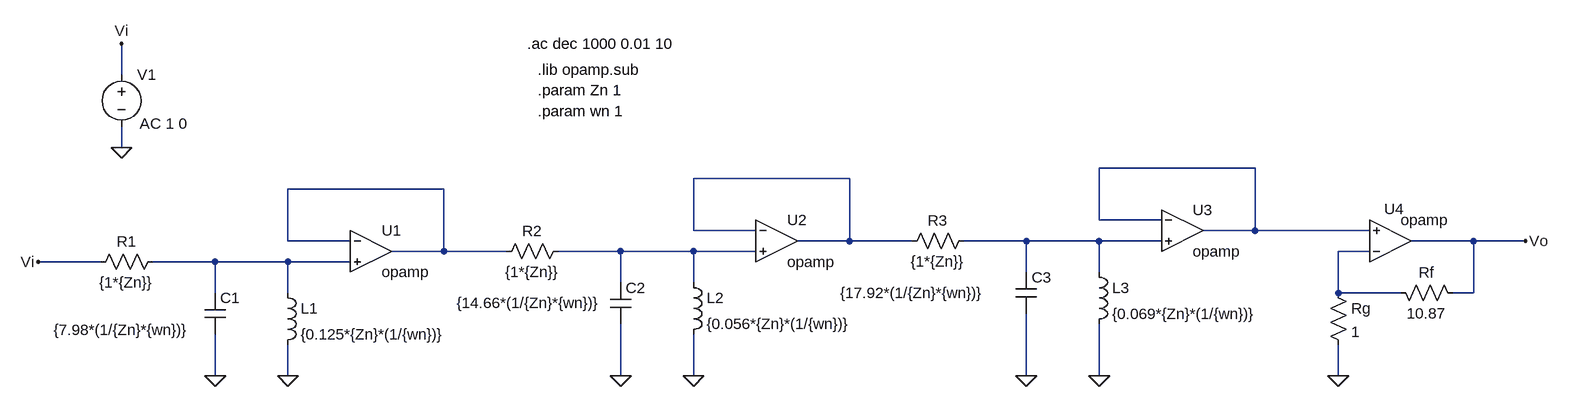
[diagram p0: schematic Circuito_norm.asc]
Circuito_norm.asc, the LTspice schematic file:
Version 4
SHEET 1 1968 680
WIRE -240 -160 -240 -208
WIRE -240 -48 -240 -80
WIRE 1504 -16 1264 -16
WIRE 880 0 640 0
WIRE 256 16 16 16
WIRE 1264 64 1264 -16
WIRE 1360 64 1264 64
WIRE 640 80 640 0
WIRE 736 80 640 80
WIRE 1504 80 1504 -16
WIRE 1504 80 1424 80
WIRE 1680 80 1504 80
WIRE 16 96 16 16
WIRE 112 96 16 96
WIRE 880 96 880 0
WIRE 880 96 800 96
WIRE 976 96 880 96
WIRE 1152 96 1056 96
WIRE 1264 96 1152 96
WIRE 1360 96 1264 96
WIRE 1840 96 1744 96
WIRE 1920 96 1840 96
WIRE 256 112 256 16
WIRE 256 112 176 112
WIRE 352 112 256 112
WIRE 528 112 432 112
WIRE 640 112 528 112
WIRE 736 112 640 112
WIRE 1680 112 1632 112
WIRE -272 128 -368 128
WIRE -96 128 -192 128
WIRE 16 128 -96 128
WIRE 112 128 16 128
WIRE 1152 144 1152 96
WIRE 1264 144 1264 96
WIRE 528 160 528 112
WIRE 640 160 640 112
WIRE -96 176 -96 128
WIRE 16 176 16 128
WIRE 1632 176 1632 112
WIRE 1728 176 1632 176
WIRE 1840 176 1840 96
WIRE 1840 176 1808 176
WIRE -96 304 -96 240
WIRE 16 304 16 256
WIRE 528 304 528 224
WIRE 640 304 640 240
WIRE 1152 304 1152 208
WIRE 1264 304 1264 224
WIRE 1632 304 1632 256
FLAG -96 304 0
FLAG 16 304 0
FLAG -368 128 Vi
FLAG -240 -208 Vi
FLAG -240 -48 0
FLAG 528 304 0
FLAG 640 304 0
FLAG 1152 304 0
FLAG 1264 304 0
FLAG 1632 304 0
FLAG 1920 96 Vo
SYMBOL OpAmps\\opamp 144 48 R0
SYMATTR InstName U1
SYMBOL res -176 112 R90
WINDOW 0 0 56 VBottom 2
WINDOW 3 32 56 VTop 2
SYMATTR InstName R1
SYMATTR Value {1*{Zn}}
SYMBOL cap -112 176 R0
WINDOW 3 -232 57 Left 2
SYMATTR Value {7.98*(1/{Zn}*{wn})}
SYMATTR InstName C1
SYMBOL ind 0 160 R0
SYMATTR InstName L1
SYMATTR Value {0.125*{Zn}*(1/{wn})}
SYMBOL OpAmps\\opamp 768 32 R0
SYMATTR InstName U2
SYMBOL res 448 96 R90
WINDOW 0 0 56 VBottom 2
WINDOW 3 32 56 VTop 2
SYMATTR InstName R2
SYMATTR Value {1*{Zn}}
SYMBOL cap 512 160 R0
WINDOW 3 -236 31 Left 2
SYMATTR Value {14.66*(1/{Zn}*{wn})}
SYMATTR InstName C2
SYMBOL ind 624 144 R0
SYMATTR InstName L2
SYMATTR Value {0.056*{Zn}*(1/{wn})}
SYMBOL OpAmps\\opamp 1392 16 R0
SYMATTR InstName U3
SYMBOL res 1072 80 R90
WINDOW 0 0 56 VBottom 2
WINDOW 3 32 56 VTop 2
SYMATTR InstName R3
SYMATTR Value {1*{Zn}}
SYMBOL cap 1136 144 R0
WINDOW 3 -270 32 Left 2
SYMATTR Value {17.92*(1/{Zn}*{wn})}
SYMATTR InstName C3
SYMBOL ind 1248 128 R0
SYMATTR InstName L3
SYMATTR Value {0.069*{Zn}*(1/{wn})}
SYMBOL voltage -240 -176 R0
WINDOW 123 28 91 Left 2
WINDOW 39 0 0 Left 0
SYMATTR Value2 AC 1 0
SYMATTR InstName V1
SYMATTR Value ""
SYMBOL OpAmps\\opamp 1712 160 M180
WINDOW 0 -9 113 Left 2
SYMATTR InstName U4
SYMBOL res 1616 160 R0
SYMATTR InstName Rg
SYMATTR Value 1
SYMBOL res 1712 160 M90
WINDOW 0 0 56 VBottom 2
WINDOW 3 32 56 VTop 2
SYMATTR InstName Rf
SYMATTR Value 10.87
TEXT 400 -168 Left 2 !.lib opamp.sub
TEXT 400 -136 Left 2 !.param Zn 1
TEXT 400 -104 Left 2 !.param wn 1
TEXT 384 -208 Left 2 !.ac dec 1000 0.01 10

The netlist it stands for:
* Circuito_norm.asc
XU1 N003 N007 N003 opamp Aol=100K GBW=10Meg  ; pins invin noninvin out
R1 N007 Vi {1*{Zn}}
C1 N007 0 {7.98*(1/{Zn}*{wn})}
L1 N007 0 {0.125*{Zn}*(1/{wn})}
XU2 N002 N005 N002 opamp Aol=100K GBW=10Meg  ; pins invin noninvin out
R2 N005 N003 {1*{Zn}}
C2 N005 0 {14.66*(1/{Zn}*{wn})}
L2 N005 0 {0.056*{Zn}*(1/{wn})}
XU3 N001 N004 N001 opamp Aol=100K GBW=10Meg  ; pins invin noninvin out
R3 N004 N002 {1*{Zn}}
C3 N004 0 {17.92*(1/{Zn}*{wn})}
L3 N004 0 {0.069*{Zn}*(1/{wn})}
V1 Vi 0 AC 1 0
XU4 N006 N001 Vo opamp Aol=100K GBW=10Meg  ; pins invin noninvin out
Rg N006 0 1
Rf N006 Vo 10.87
.lib opamp.sub
.param Zn 1
.param wn 1
.ac dec 1000 0.01 10
.backanno
.end